# EAGLE design tube_power (EAGLE 6.6.0)
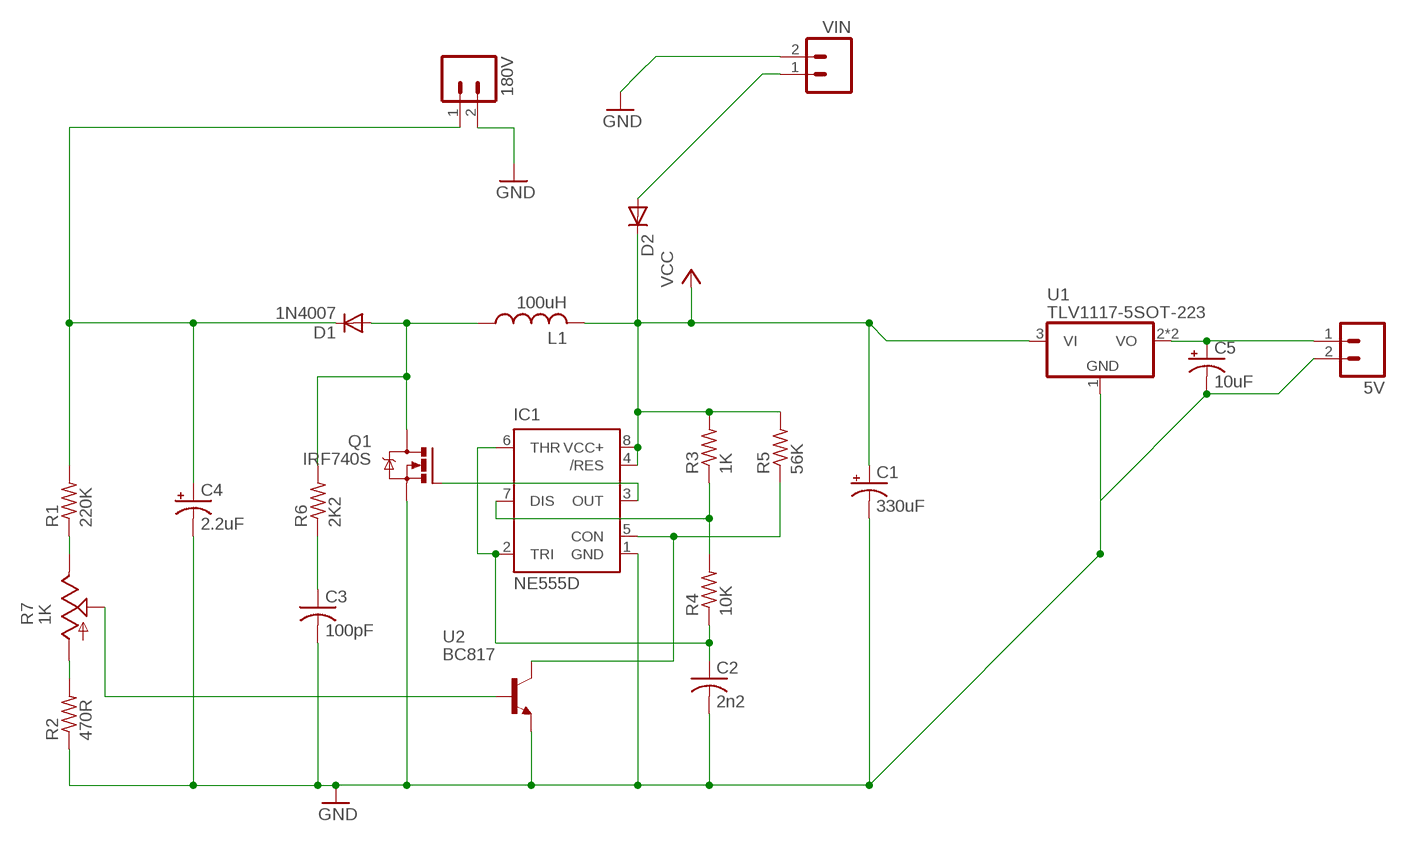
[diagram p0: schematic, sheet 1]

## Parts
5V  M023.5MM  [SCREWTERMINAL-3.5MM-2]
180V  M023.5MM  [SCREWTERMINAL-3.5MM-2]
C1  330uF  CAPACITOR_POLE5-10.5  [E5-10,5]
C2  2n2  CAPACITORC0805K  [C0805K]
C3  100pF  CAPACITORC0805K  [C0805K]
C4  2.2uF  CAPACITOR_POLE5-10.5  [E5-10,5]
C5  10uF  CAPACITOR_POLE2-5  [E2-5]
D1  1N4007  DIODESMA  [SMA-DIODE]
D2  DIODESMA  [SMA-DIODE]
IC1  NE555D  [SO08]
L1  100uH  INDUCTOR  [RBL0712]
Q1  IRF740S  [TO263]
R1  220K  RESISTOR0207/10  [0207/10]
R2  470R  RESISTOR0207/10  [0207/10]
R3  1K  RESISTORR0805  [R0805]
R4  10K  RESISTORR0805  [R0805]
R5  56K  RESISTORR0805  [R0805]
R6  2K2  RESISTORR0805  [R0805]
R7  1K  TRIM_POTCA6V  [CA6V]
U1  TLV1117-5SOT-223  [SOT-223]
U2  BC817  [SOT-23]
VIN  M023.5MM  [SCREWTERMINAL-3.5MM-2]

## Nets
5V [power]: 5V.1 C5.+ U1.2(VO) U1.4(VO)
180V [power]: 180V.1 C4.+ D1.C R1.2
CON: IC1.5(CON) R5.1 U2.3(C)
DIS: IC1.7(DIS) R3.1 R4.2
GND [ground]: 5V.2 180V.2 C1.- C2.2 C3.2 C4.- C5.- IC1.1(GND) Q1.2(S) R2.1 U1.1(GND) U2.2(E) VIN.2
L1: D1.A L1.P$1 Q1.3(D) R6.2
N$1: D2.A VIN.1
OUT: IC1.3(OUT) Q1.1(G)
R1: R1.1 R7.E
R2: R2.2 R7.A
R6: C3.1 R6.1
THR: C2.1 IC1.2(TRI) IC1.6(THR) R4.1
VAR: R7.S U2.1(B)
VCC: C1.+ D2.C IC1.4(/RES) IC1.8(VCC+) L1.P$2 R3.2 R5.2 U1.3(VI)

## Library data of the parts
5V 180V VIN = iStivi - Header-Connector:M02: Header 2 Standard 2-pin 0.1" header. Use with straight break away headers (SKU : PRT-00116), right angle break away headers (PRT-00553), swiss pins (PRT-00743), machine pins (PRT-00117), and female headers (PRT-00115). Molex polarized connector foot print use with SKU : PRT-08233 with associated crimp pins and housings.
C1 C4 C5 = iStivi - RCLD:CAPACITOR_POL: POLARIZED CAPACITOR, American symbol
C2 C3 = iStivi - RCLD:CAPACITOR: CAPACITOR, American symbol
D1 D2 = iStivi - RCLD:DIODE: Diode These are standard reverse protection diodes and small signal diodes.
IC1 = iStivi - ICs:NE555: Timer General purpose bipolar Timer
L1 = iStivi - RCLD:INDUCTOR: INDUCTOR
Q1 = iStivi - Transistor-FET-reg:IRF740: N-CHANNEL MOS FET 400V MOSFET
R1-R6 = iStivi - RCLD:RESISTOR: RESISTOR
R7 = iStivi - RCLD:TRIM_POT: POTENTIOMETER
U1 = iStivi - Transistor-FET-reg:TLV1117-5: Fixed 5V regulator SMD fixed 5V regulator TLV117-5
U2 = iStivi - Transistor-FET-reg:BC817: BC817 NPN Transistor NPN transistor

## Net classes
1 ground: width 0.356 mm
2 power: width 0.356 mm

## Board
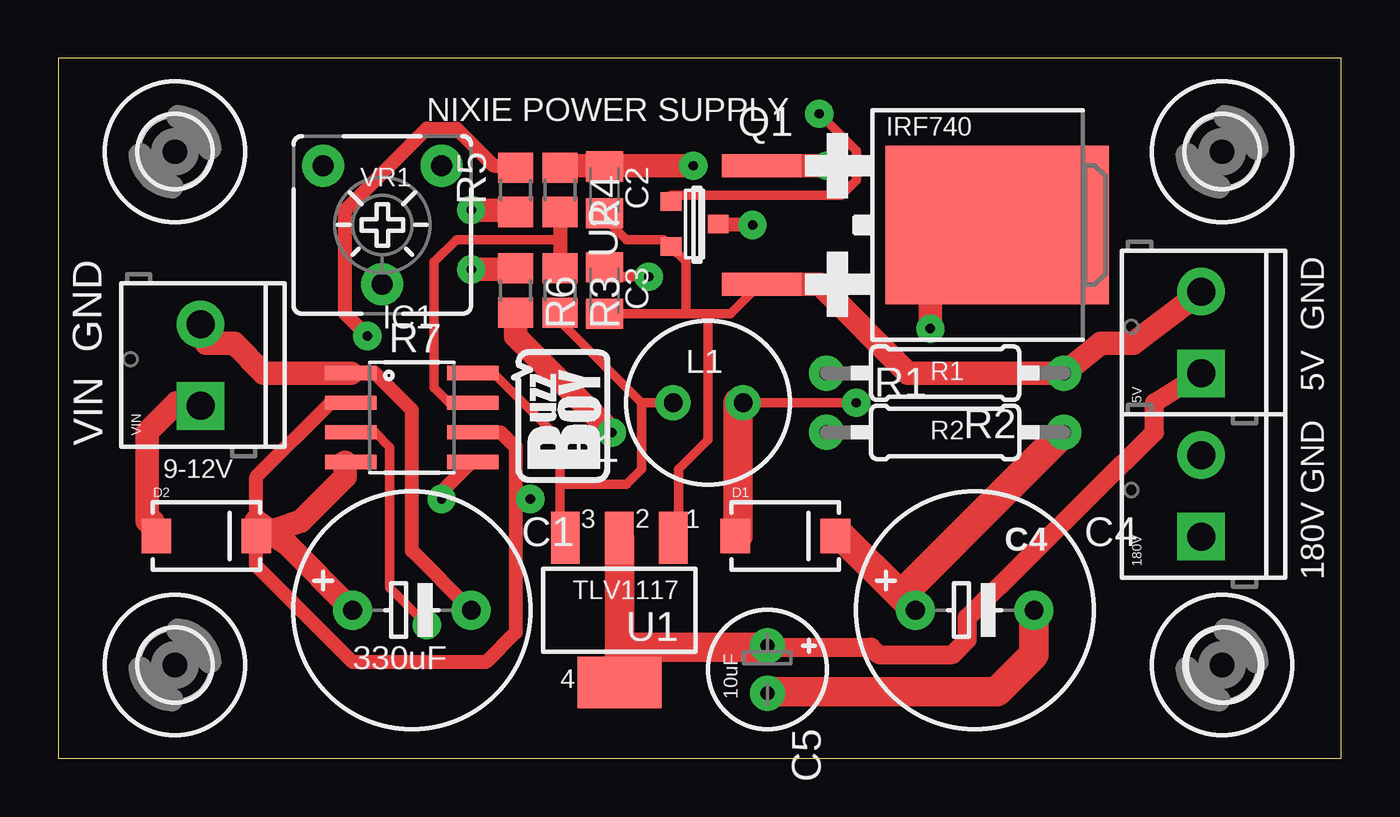
[diagram p1: board, top side]
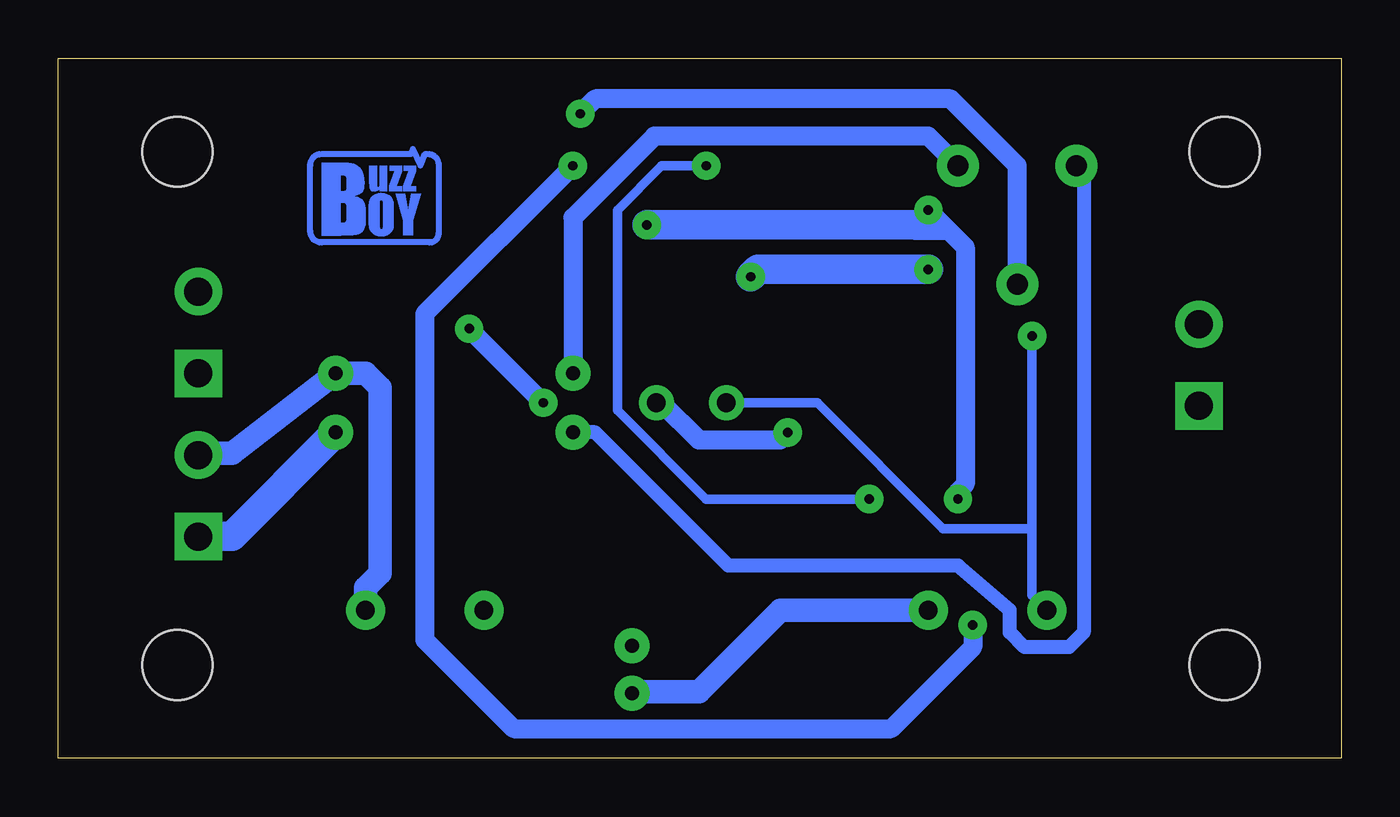
[diagram p2: board, bottom side, seen from below]

Size 55 x 30 mm. Coordinates in mm from the lower left corner, seen from the top.
Outline: 0,0 55,0 55,30 0,30 0,0
Copper layers (1*16): Top 0.035mm / dielectric 1.5mm / Bottom 0.035mm
Design rules "iStivi-0.8mm via-12mil-track *": minimum track width 16mil, minimum drill 0.4mm, track to track 12mil, track to pad 12mil, pad to pad 10mil, via to via 16mil, smd to smd 10mil, copper to edge 40mil, drill to drill 8mil, minimum pad ring 10mil, minimum via ring 16mil, stop-mask expansion 0mil, vias tented up to drill 0.4mm, thermal gap 12mil

### Footprints (pad centres in the part's own frame; a part is rotated, then mirrored left to right if it is on the bottom)
SCREWTERMINAL-3.5MM-2 = drill 1.2 pad 2.032 square: 1 0,0 | drill 1.2 pad 2.032: 2 3.5,0
E5-10,5 = drill 0.8 pad 1.676: + -2.54,0; - 2.54,0
C0805K = smd 1.3 x 1.6: 1 -1,0; 2 1,0
E2-5 = drill 0.6 pad 1.5: + -1.016,0; - 1.016,0
SMA-DIODE = smd 1.27 x 1.47: A -2.15,0; C 2.15,0
SO08 = smd 0.61 x 2.21: 1 -1.905,-2.616; 2 -0.635,-2.616; 3 0.635,-2.616; 4 1.905,-2.616; 5 1.905,2.616; 6 0.635,2.616; 7 -0.635,2.616; 8 -1.905,2.616
RBL0712 = drill 0.8 pad 1.5: P$1 -1.5,0; P$2 1.5,0
TO263 = smd 1 x 3.4: 1 -2.54,-6.6; 2 2.54,-6.6 | smd 6.8 x 9.6: 3 0,3.5
0207/10 = drill 0.6 pad 1.5: 1 -5.08,0; 2 5.08,0
R0805 = smd 1.3 x 1.5: 1 -0.95,0; 2 0.95,0
CA6V = drill 0.9 pad 1.8: A -2.54,-2.54; E 2.54,-2.54; S 0,2.54
SOT-223 = smd 1.219 x 2.235: 1 -2.311,-3.099; 2 0,-3.099; 3 2.311,-3.099 | smd 3.6 x 2.2: 4 0,3.099
SOT-23 = smd 0.787 x 0.889: 1 0.991,1.016; 2 -0.94,1.016; 3 0.025,-1.016
3,0-SMALL = hole 3: 0,0

### Placement (x,y rotation side)
5V  49,16.5 90 top
180V  49,9.5 90 top
C1  15.16,6.35 0 top
C2  23.41,24.36 270 top
C3  23.41,20.05 270 top
C4  39.29,6.35 0 top
C5  30.4,3.81 270 top
D1  31.17,9.53 0 top
D2  6.35,9.53 0 top
IC1  15.16,14.61 270 top
L1  27.86,15.24 180 top
Q1  36.75,22.86 270 top
R1  38.02,13.97 0 top
R2  38.02,16.51 180 top
R3  21.51,20.05 270 top
R4  21.51,24.36 270 top
R5  19.61,24.36 90 top
R6  19.61,20.05 270 top
R7  13.89,22.86 180 top
U1  24.05,6.35 180 top
U2  27.28,22.87 90 top
U$1  [3,0-SMALL]  5,26 0 top
U$2  [3,0-SMALL]  5,4 0 top
U$3  [BUZZBOY-SILK]  21.19,14.29 90 top
U$4  [3,0-SMALL]  49.89,4 0 top
U$5  [3,0-SMALL]  49.89,26 0 top
U$6  [BUZZBOY]  44.37,21.91 0 bottom
VIN  6.09,15.11 90 top

### Tracks (layer width: path | path; a pad name or v marks a point on that pad's centre or on a via)
5V
  Top 0.406: 30.4,4.76 C5.+
  Top 0.813: 30.4,4.76 34.84,4.76 35.16,4.45 38.34,4.45 38.97,5.08 38.97,6.03 46.99,13.97 46.99,15.24 5V.1
  Top 1.27: U1.4 24.05,4.76 | 24.05,4.76 U1.2 | 24.05,4.76 30.4,4.76
180V
  Top 0.406: 33.58,9.53 D1.C
  Top 1.27: C4.+ 36.12,6.99 | 36.12,6.99 33.58,9.53 | 36.12,6.99 R1.2
  Bottom 0.406: 49.09,9.53 180V.1
  Bottom 1.27: 49.09,9.53 47.55,9.53 R1.2
CON  (via drill 0.4)
  Top 0.406: 28.5,22.86 U2.3 | 19.61,23.5 R5.1 | v16.43,11.11 16.43,11.43 | 17.7,12.7 IC1.5
  Top 0.61: v29.77,22.86 28.5,22.86 | 16.43,11.43 17.7,12.7
  Top 1.016: 19.61,23.5 v17.7,23.5
  Bottom 0.813: 18.34,22.86 v17.7,23.5 16.11,21.91 16.11,11.75 16.43,11.43 v16.43,11.11
  Bottom 1.27: 18.34,22.86 v29.77,22.86
DIS
  Top 0.406: IC1.7 16.75,15.24 16.11,15.88 16.11,21.27 17.07,22.23 21.51,22.23
  Top 0.61: R4.2 21.51,22.23 R3.1
GND
  Top 0.406: C2.2 23.41,23.18 24.37,22.23 25.95,22.23 U2.2 26.27,21.91 26.91,21.27 26.91,19.05 | 27.86,19.05 28.81,19.05 30.08,20.32 Q1.2 | 27.86,19.05 26.91,19.05 | 26.91,19.05 C3.2 | 27.86,19.05 27.86,13.65 26.59,12.38 26.59,9.53 U1.1 | 30.4,2.86 C5.-
  Top 0.61: IC1.1 13.57,16.51 15.16,14.92 15.16,8.89 C1.-
  Top 1.016: 5V.2 46.09,17.78 44.69,17.78 R2.1 36.43,16.51 32.62,20.32 Q1.2 | IC1.1 8.81,16.51 7.54,17.78 6.35,17.78 VIN.2
  Top 1.27: 30.4,2.86 40.24,2.86 41.83,4.45 C4.-
  Bottom 0.406: 49.09,13.06 180V.2
  Bottom 1.016: 49.09,13.06 47.55,13.06 R2.1 41.83,16.51 41.2,15.88 41.2,7.94 41.83,7.3 C4.- | C1.- 24.05,6.35 27.54,2.86 30.34,2.86 C5.-
L1  (via drill 0.4)
  Top 0.406: 29.13,9.53 D1.A | 29.13,15.24 L1.P$1 v34.21,15.24 | 37.38,20 Q1.3
  Top 1.016: R6.2 19.61,18.1 v23.73,13.97 | 37.38,20 v37.38,18.41
  Top 1.27: 29.13,15.24 29.13,9.53
  Bottom 0.813: v37.38,18.41 v34.21,15.24 | L1.P$1 29.13,15.24 27.54,13.65 24.05,13.65 v23.73,13.97
N$1
  Top 0.406: 4.05,10.16 D2.A
  Top 1.016: 4.05,10.16 3.81,10.16 3.81,13.97 5.08,15.24 5.71,15.24 5.85,15.11 VIN.1
OUT  (via drill 0.4)
  Top 0.406: IC1.3 13.57,13.97 14.21,13.34 14.21,7.3 v15.79,5.71
  Top 1.016: Q1.1 v32.94,25.4
  Bottom 0.813: v32.94,25.4 39.29,19.05 39.29,5.08 35.48,1.27 19.29,1.27 15.79,4.76 v15.79,5.71
R1
  Bottom 0.61: R1.1 31.99,13.97 26.27,8.26 16.43,8.26 14.21,6.35 14.21,5.4 13.57,4.76 11.67,4.76 11.03,5.4 11.03,25.08 R7.E
R2
  Bottom 0.813: R2.2 32.94,23.18 29.45,26.67 17.7,26.67 R7.A
R6  (via drill 0.4)
  Top 0.406: v25.32,20.64 23.73,20.64 23.41,20.95 C3.1 | 19.61,20.95 R6.1
  Top 1.016: v17.7,20.95 19.61,20.95
  Bottom 1.27: v17.7,20.95 25,20.95 v25.32,20.64
THR  (via drill 0.4)
  Top 0.406: 21.51,25.4 R4.1 | 11.67,15.24 IC1.2 | 19.61,11.11 v20.24,11.11 | 23.41,25.4 C2.1
  Top 0.61: 11.67,15.24 8.49,12.06 8.49,8.26 12.62,4.13 18.34,4.13 19.61,5.4 19.61,11.11 19.61,13.34 18.97,13.97 IC1.6
  Top 1.016: 21.51,25.4 23.41,25.4 v27.23,25.4
  Bottom 0.406: v27.23,25.4 29.13,25.4 31.04,23.5 31.04,14.92 27.23,11.11 v20.24,11.11
VAR  (via drill 0.4)
  Top 0.406: v32.62,27.62 34.21,26.04 34.21,24.77 33.58,24.13 26.27,24.13 U2.1
  Bottom 0.813: v32.62,27.62 31.99,28.26 16.75,28.26 13.89,25.4 R7.S
VCC  (via drill 0.4)
  Top 0.406: R3.2 21.51,18.73 25,15.24 | L1.P$2 25,15.24 | IC1.8 18.65,16.51 21.51,13.65 21.51,11.75 | 21.51,11.75 21.51,9.53 U1.3 | 25,15.24 25,12.38 24.37,11.75 21.51,11.75 | 12.3,12.7 IC1.4 | 19.61,25.4 R5.2
  Top 0.61: 19.61,25.4 18.65,25.4 17.07,26.99 15.79,26.99 12.3,23.5 12.3,19.05 v13.26,18.1
  Top 1.016: 12.3,12.7 arc0 12.3,12.06 10.4,10.16 D2.C 8.49,10.16 9.76,9.21 C1.+
  Bottom 0.406: 13.26,9.84 13.26,6.99 C1.+ | 13.26,9.84 v13.26,18.1 | L1.P$2 22.46,15.24 17.07,9.84 13.26,9.84
(copper drawn outside any net)
  shapes: Bottom area x1

### Text on the board
_tplace: NIXIE POWER SUPPLY | IRF740 | VR1 | GND | 5V | GND | L1 | R1 | R2 | GND | VIN | 9-12V | 180V | C4 | TLV1117 | 330uF | 10uF